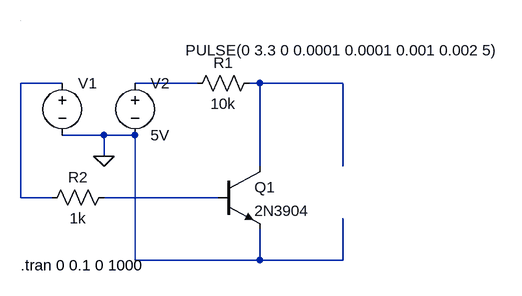
[diagram p0: schematic LED_33to5Inv.asc]
LED_33to5Inv.asc, the LTspice schematic file:
Version 4
SHEET 1 880 680
WIRE 64 96 0 96
WIRE 272 96 176 96
WIRE 368 96 352 96
WIRE 496 96 368 96
WIRE 128 176 64 176
WIRE 176 176 128 176
WIRE 128 208 128 176
WIRE 368 224 368 96
WIRE 496 224 496 96
WIRE 0 272 0 96
WIRE 48 272 0 272
WIRE 304 272 128 272
WIRE 176 368 176 176
WIRE 368 368 368 320
WIRE 368 368 176 368
WIRE 496 368 496 304
WIRE 496 368 368 368
WIRE 0 0 0 0
FLAG 128 208 0
SYMBOL voltage 64 80 R0
WINDOW 3 190 -35 Left 2
WINDOW 123 0 0 Left 0
WINDOW 39 0 0 Left 0
SYMATTR InstName V1
SYMATTR Value PULSE(0 3.3 0 0.0001 0.0001 0.001 0.002 5)
SYMBOL voltage 176 80 R0
WINDOW 123 0 0 Left 0
WINDOW 39 0 0 Left 0
SYMATTR InstName V2
SYMATTR Value 5V
SYMBOL npn 304 224 R0
SYMATTR InstName Q1
SYMATTR Value 2N3904
SYMBOL res 368 80 R90
WINDOW 0 0 56 VBottom 2
WINDOW 3 32 56 VTop 2
SYMATTR InstName R1
SYMATTR Value 10k
SYMBOL res 144 256 R90
WINDOW 0 0 56 VBottom 2
WINDOW 3 32 56 VTop 2
SYMATTR InstName R2
SYMATTR Value 1k
TEXT 0 376 Left 2 !.tran 0 0.1 0 1000

The netlist it stands for:
* LED_33to5Inv.asc
V1 N001 0 PULSE(0 3.3 0 0.0001 0.0001 0.001 0.002 5)
V2 N002 0 5V
Q1 N003 N004 0 0 2N3904
R1 N003 N002 10k
R2 N004 N001 1k
.model NPN NPN
.model PNP PNP
.lib standard.bjt
.tran 0 0.1 0 1000
.backanno
.end